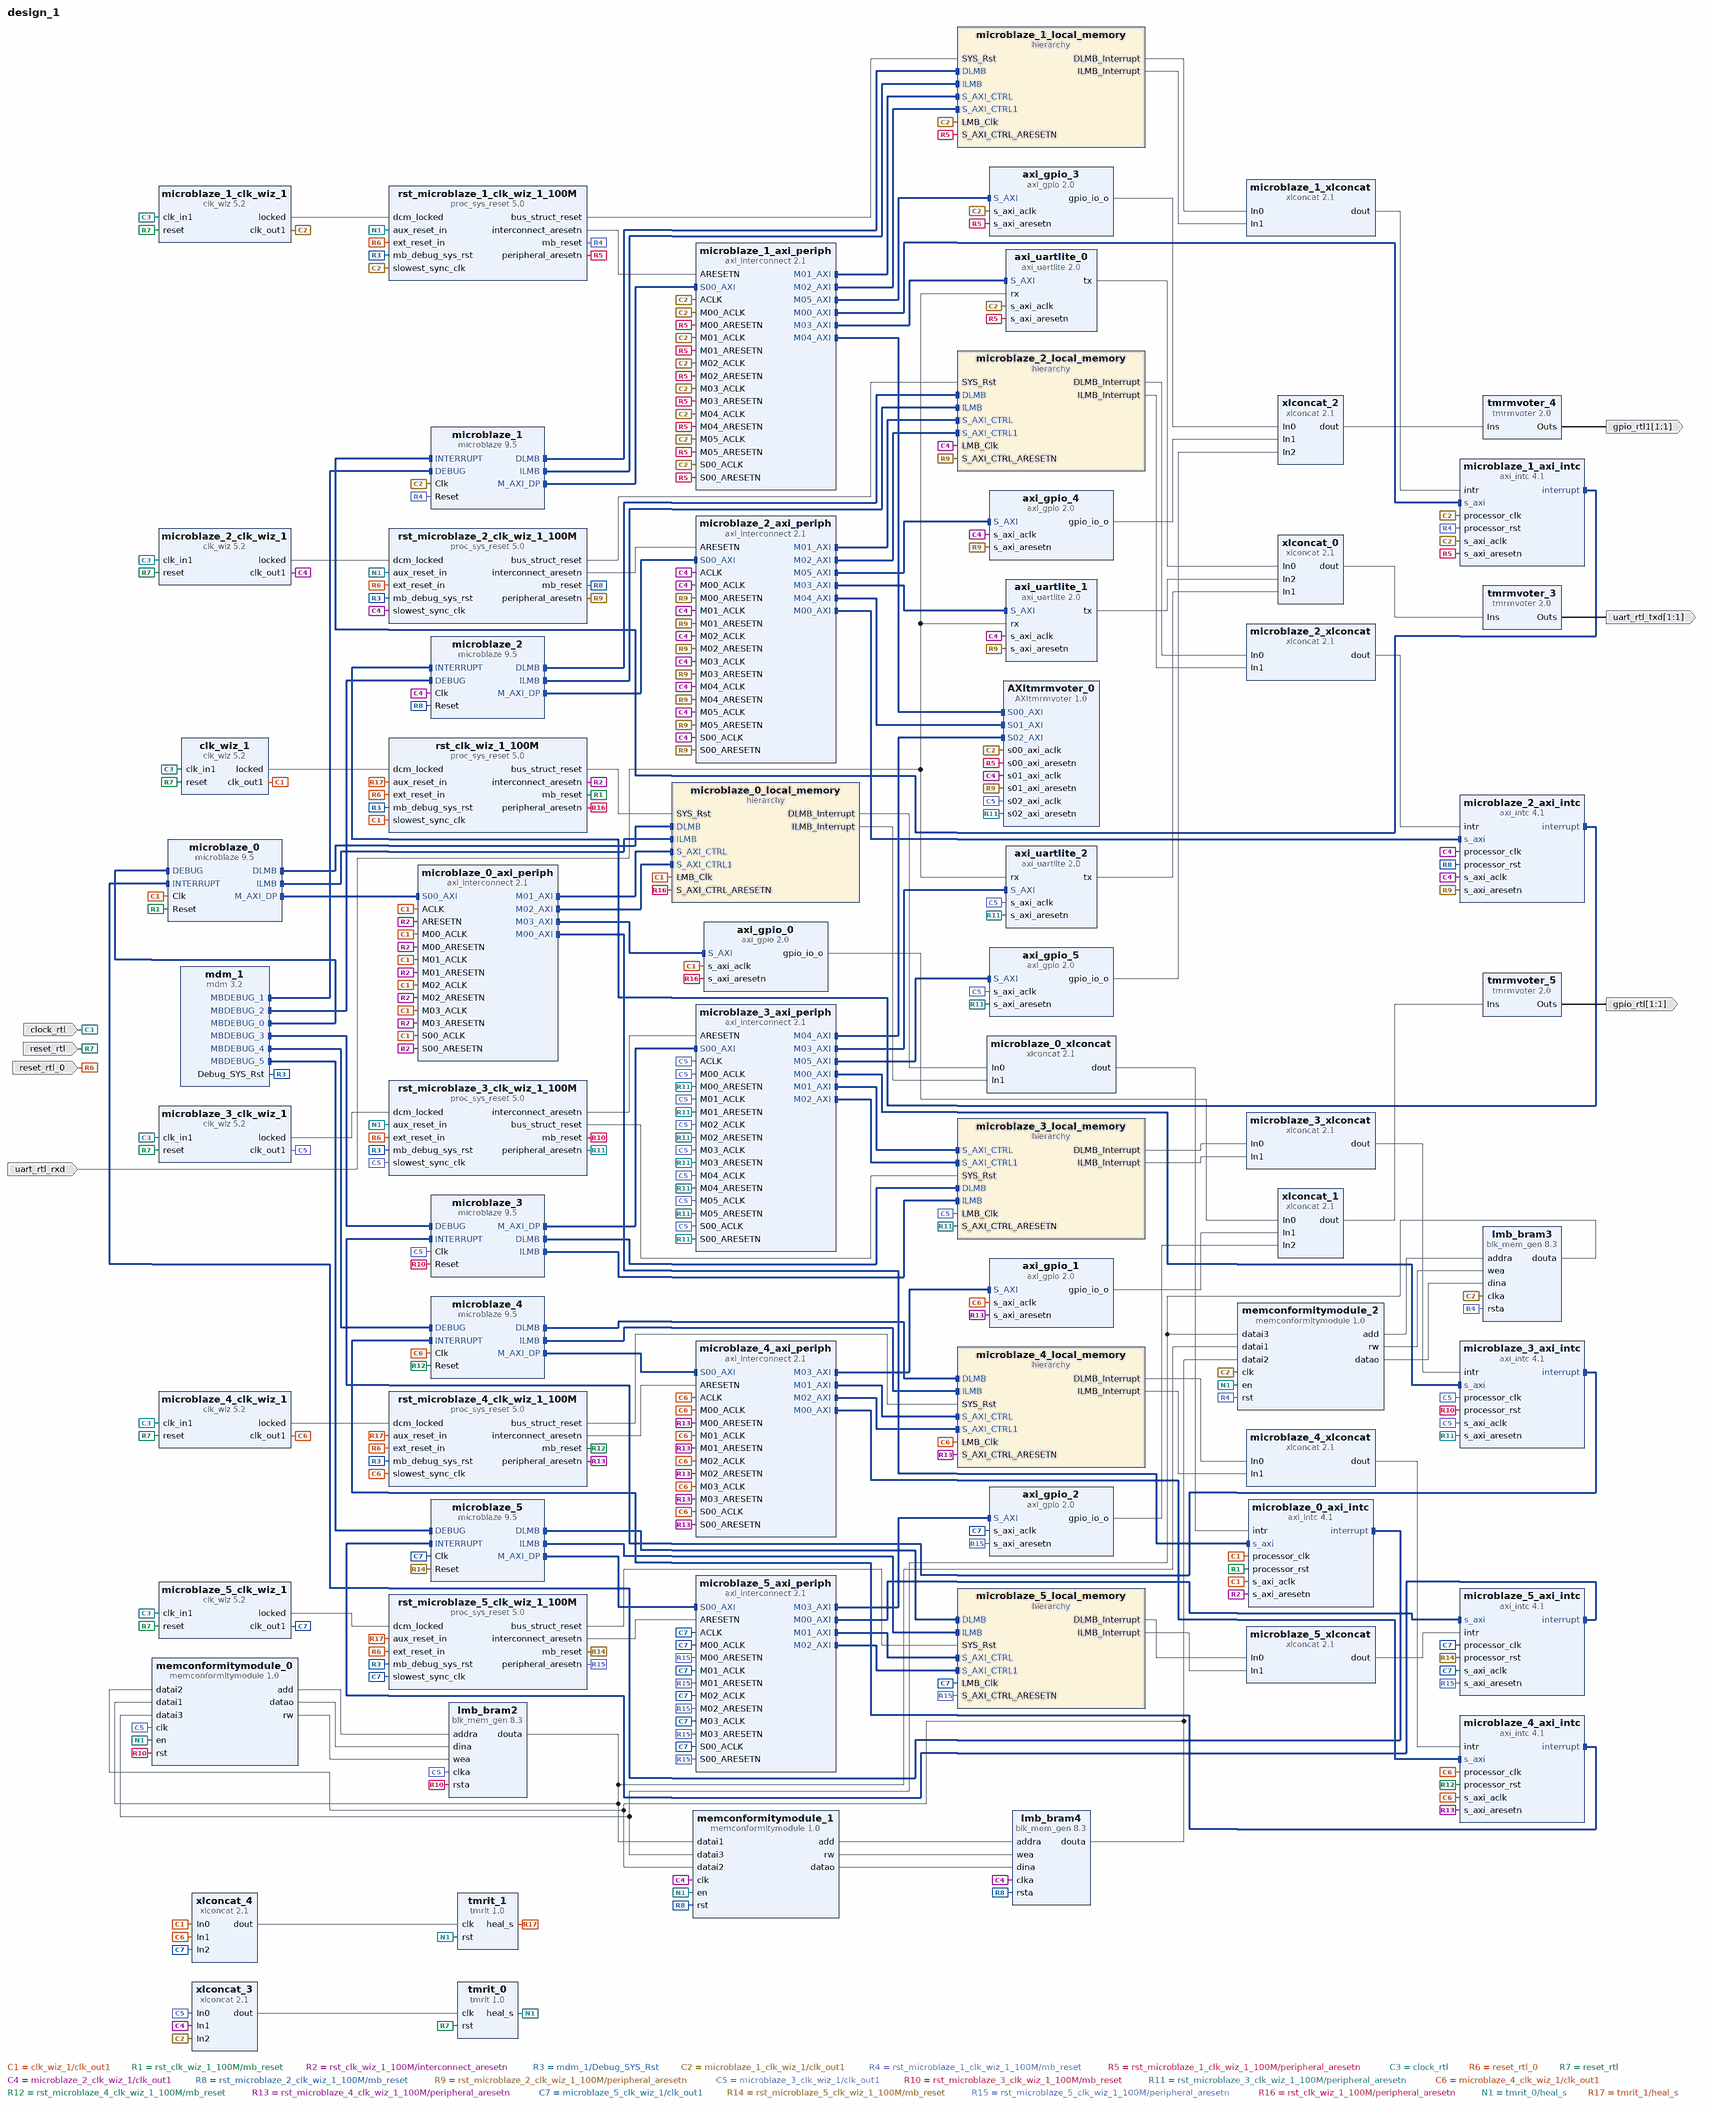
[diagram p0: block diagram of the top level]
# Vivado block design design_1, Vivado 2015.4
create_bd_design design_1

create_bd_port -dir I -type clk clock_rtl
set_property -dict {CONFIG.FREQ_HZ 100000000 CONFIG.PHASE 0.000} [get_bd_ports clock_rtl]
create_bd_port -dir I -type rst reset_rtl_0
set_property -dict {CONFIG.POLARITY ACTIVE_LOW} [get_bd_ports reset_rtl_0]
create_bd_port -dir I -type rst reset_rtl
set_property -dict {CONFIG.POLARITY ACTIVE_HIGH} [get_bd_ports reset_rtl]
create_bd_port -dir I uart_rtl_rxd
create_bd_port -dir O -from 1 -to 1 uart_rtl_txd
create_bd_port -dir O -from 1 -to 1 gpio_rtl1
create_bd_port -dir O -from 1 -to 1 gpio_rtl

create_bd_cell -type ip -vlnv xilinx.com:ip:axi_uartlite:2.0 axi_uartlite_0
create_bd_cell -type hier microblaze_0_local_memory
create_bd_cell -type ip -vlnv xilinx.com:ip:axi_intc:4.1 microblaze_0_axi_intc
set_property -dict {CONFIG.C_HAS_FAST 1} [get_bd_cells microblaze_0_axi_intc]
create_bd_cell -type ip -vlnv xilinx.com:ip:xlconcat:2.1 microblaze_0_xlconcat
create_bd_cell -type ip -vlnv xilinx.com:ip:mdm:3.2 mdm_1
set_property -dict {CONFIG.C_MB_DBG_PORTS 6} [get_bd_cells mdm_1]
create_bd_cell -type ip -vlnv xilinx.com:ip:proc_sys_reset:5.0 rst_clk_wiz_1_100M
set_property -dict {CONFIG.C_AUX_RESET_HIGH 1 CONFIG.C_AUX_RST_WIDTH 1} [get_bd_cells rst_clk_wiz_1_100M]
create_bd_cell -type hier microblaze_1_local_memory
create_bd_cell -type ip -vlnv xilinx.com:ip:axi_intc:4.1 microblaze_1_axi_intc
set_property -dict {CONFIG.C_HAS_FAST 1} [get_bd_cells microblaze_1_axi_intc]
create_bd_cell -type ip -vlnv xilinx.com:ip:xlconcat:2.1 microblaze_1_xlconcat
create_bd_cell -type ip -vlnv xilinx.com:ip:proc_sys_reset:5.0 rst_microblaze_1_clk_wiz_1_100M
set_property -dict {CONFIG.C_AUX_RESET_HIGH 1 CONFIG.C_AUX_RST_WIDTH 1} [get_bd_cells rst_microblaze_1_clk_wiz_1_100M]
create_bd_cell -type ip -vlnv xilinx.com:ip:axi_uartlite:2.0 axi_uartlite_1
create_bd_cell -type hier microblaze_2_local_memory
create_bd_cell -type ip -vlnv xilinx.com:ip:axi_intc:4.1 microblaze_2_axi_intc
set_property -dict {CONFIG.C_HAS_FAST 1} [get_bd_cells microblaze_2_axi_intc]
create_bd_cell -type ip -vlnv xilinx.com:ip:xlconcat:2.1 microblaze_2_xlconcat
create_bd_cell -type ip -vlnv xilinx.com:ip:proc_sys_reset:5.0 rst_microblaze_2_clk_wiz_1_100M
set_property -dict {CONFIG.C_AUX_RESET_HIGH 1 CONFIG.C_AUX_RST_WIDTH 1} [get_bd_cells rst_microblaze_2_clk_wiz_1_100M]
create_bd_cell -type hier microblaze_3_local_memory
create_bd_cell -type ip -vlnv xilinx.com:ip:axi_intc:4.1 microblaze_3_axi_intc
set_property -dict {CONFIG.C_HAS_FAST 1} [get_bd_cells microblaze_3_axi_intc]
create_bd_cell -type ip -vlnv xilinx.com:ip:xlconcat:2.1 microblaze_3_xlconcat
create_bd_cell -type ip -vlnv xilinx.com:ip:proc_sys_reset:5.0 rst_microblaze_3_clk_wiz_1_100M
set_property -dict {CONFIG.C_AUX_RESET_HIGH 1 CONFIG.C_AUX_RST_WIDTH 1} [get_bd_cells rst_microblaze_3_clk_wiz_1_100M]
create_bd_cell -type ip -vlnv xilinx.com:ip:axi_uartlite:2.0 axi_uartlite_2
create_bd_cell -type ip -vlnv xilinx.com:ip:xlconcat:2.1 xlconcat_0
set_property -dict {CONFIG.NUM_PORTS 3 CONFIG.IN0_WIDTH 1 CONFIG.IN1_WIDTH 1 CONFIG.IN2_WIDTH 1} [get_bd_cells xlconcat_0]
create_bd_cell -type hier microblaze_4_local_memory
create_bd_cell -type ip -vlnv xilinx.com:ip:axi_intc:4.1 microblaze_4_axi_intc
set_property -dict {CONFIG.C_HAS_FAST 1} [get_bd_cells microblaze_4_axi_intc]
create_bd_cell -type ip -vlnv xilinx.com:ip:xlconcat:2.1 microblaze_4_xlconcat
create_bd_cell -type ip -vlnv xilinx.com:ip:proc_sys_reset:5.0 rst_microblaze_4_clk_wiz_1_100M
set_property -dict {CONFIG.C_AUX_RESET_HIGH 1 CONFIG.C_AUX_RST_WIDTH 1} [get_bd_cells rst_microblaze_4_clk_wiz_1_100M]
create_bd_cell -type ip -vlnv xilinx.com:ip:xlconcat:2.1 xlconcat_1
set_property -dict {CONFIG.NUM_PORTS 3 CONFIG.IN0_WIDTH 1 CONFIG.IN1_WIDTH 1 CONFIG.IN2_WIDTH 1} [get_bd_cells xlconcat_1]
create_bd_cell -type hier microblaze_5_local_memory
create_bd_cell -type ip -vlnv xilinx.com:ip:axi_intc:4.1 microblaze_5_axi_intc
set_property -dict {CONFIG.C_HAS_FAST 1} [get_bd_cells microblaze_5_axi_intc]
create_bd_cell -type ip -vlnv xilinx.com:ip:xlconcat:2.1 microblaze_5_xlconcat
create_bd_cell -type ip -vlnv xilinx.com:ip:proc_sys_reset:5.0 rst_microblaze_5_clk_wiz_1_100M
set_property -dict {CONFIG.C_AUX_RESET_HIGH 1 CONFIG.C_AUX_RST_WIDTH 1} [get_bd_cells rst_microblaze_5_clk_wiz_1_100M]
create_bd_cell -type ip -vlnv xilinx.com:ip:axi_gpio:2.0 axi_gpio_0
set_property -dict {CONFIG.C_GPIO_WIDTH 1 CONFIG.C_ALL_OUTPUTS 1} [get_bd_cells axi_gpio_0]
create_bd_cell -type ip -vlnv xilinx.com:ip:axi_gpio:2.0 axi_gpio_1
set_property -dict {CONFIG.C_GPIO_WIDTH 1 CONFIG.C_ALL_OUTPUTS 1} [get_bd_cells axi_gpio_1]
create_bd_cell -type ip -vlnv xilinx.com:ip:axi_gpio:2.0 axi_gpio_2
set_property -dict {CONFIG.C_GPIO_WIDTH 1 CONFIG.C_ALL_OUTPUTS 1} [get_bd_cells axi_gpio_2]
create_bd_cell -type ip -vlnv xilinx.com:ip:clk_wiz:5.2 clk_wiz_1
set_property -dict [list \
  CONFIG.USE_MIN_POWER true \
  CONFIG.JITTER_SEL No_Jitter \
  CONFIG.CLKOUT1_REQUESTED_OUT_FREQ 10 \
  CONFIG.PRIM_SOURCE Single_ended_clock_capable_pin \
  CONFIG.MMCM_DIVCLK_DIVIDE 10 \
  CONFIG.MMCM_CLKFBOUT_MULT_F 60.125 \
  CONFIG.MMCM_CLKOUT0_DIVIDE_F 60.125 \
  CONFIG.MMCM_CLKOUT0_DUTY_CYCLE 0.5 \
  CONFIG.CLKOUT1_JITTER 884.502 \
  CONFIG.CLKOUT1_PHASE_ERROR 871.302 \
] [get_bd_cells clk_wiz_1]
create_bd_cell -type ip -vlnv xilinx.com:ip:microblaze:9.5 microblaze_0
set_property -dict [list \
  CONFIG.C_FAULT_TOLERANT 1 \
  CONFIG.C_D_AXI 1 \
  CONFIG.C_D_LMB 1 \
  CONFIG.C_I_LMB 1 \
  CONFIG.C_DEBUG_ENABLED 1 \
] [get_bd_cells microblaze_0]
create_bd_cell -type ip -vlnv xilinx.com:ip:microblaze:9.5 microblaze_1
set_property -dict [list \
  CONFIG.C_FAULT_TOLERANT 1 \
  CONFIG.C_D_AXI 1 \
  CONFIG.C_D_LMB 1 \
  CONFIG.C_I_LMB 1 \
  CONFIG.C_DEBUG_ENABLED 1 \
] [get_bd_cells microblaze_1]
create_bd_cell -type ip -vlnv xilinx.com:ip:microblaze:9.5 microblaze_4
set_property -dict [list \
  CONFIG.C_FAULT_TOLERANT 1 \
  CONFIG.C_D_AXI 1 \
  CONFIG.C_D_LMB 1 \
  CONFIG.C_I_LMB 1 \
  CONFIG.C_DEBUG_ENABLED 1 \
] [get_bd_cells microblaze_4]
create_bd_cell -type ip -vlnv xilinx.com:ip:axi_interconnect:2.1 microblaze_0_axi_periph
set_property -dict {CONFIG.NUM_MI 4} [get_bd_cells microblaze_0_axi_periph]
create_bd_cell -type ip -vlnv xilinx.com:ip:microblaze:9.5 microblaze_2
set_property -dict [list \
  CONFIG.C_FAULT_TOLERANT 1 \
  CONFIG.C_D_AXI 1 \
  CONFIG.C_D_LMB 1 \
  CONFIG.C_I_LMB 1 \
  CONFIG.C_DEBUG_ENABLED 1 \
] [get_bd_cells microblaze_2]
create_bd_cell -type ip -vlnv xilinx.com:ip:axi_interconnect:2.1 microblaze_1_axi_periph
set_property -dict {CONFIG.NUM_MI 6} [get_bd_cells microblaze_1_axi_periph]
create_bd_cell -type ip -vlnv xilinx.com:ip:clk_wiz:5.2 microblaze_1_clk_wiz_1
set_property -dict [list \
  CONFIG.USE_MIN_POWER true \
  CONFIG.JITTER_SEL No_Jitter \
  CONFIG.CLKOUT1_REQUESTED_OUT_FREQ 10 \
  CONFIG.PRIM_SOURCE Single_ended_clock_capable_pin \
  CONFIG.MMCM_DIVCLK_DIVIDE 10 \
  CONFIG.MMCM_CLKFBOUT_MULT_F 60.125 \
  CONFIG.MMCM_CLKOUT0_DIVIDE_F 60.125 \
  CONFIG.MMCM_CLKOUT0_DUTY_CYCLE 0.5 \
  CONFIG.CLKOUT1_JITTER 884.502 \
  CONFIG.CLKOUT1_PHASE_ERROR 871.302 \
] [get_bd_cells microblaze_1_clk_wiz_1]
create_bd_cell -type ip -vlnv xilinx.com:ip:microblaze:9.5 microblaze_3
set_property -dict [list \
  CONFIG.C_FAULT_TOLERANT 1 \
  CONFIG.C_D_AXI 1 \
  CONFIG.C_D_LMB 1 \
  CONFIG.C_I_LMB 1 \
  CONFIG.C_DEBUG_ENABLED 1 \
] [get_bd_cells microblaze_3]
create_bd_cell -type ip -vlnv xilinx.com:ip:axi_interconnect:2.1 microblaze_2_axi_periph
set_property -dict {CONFIG.NUM_MI 6} [get_bd_cells microblaze_2_axi_periph]
create_bd_cell -type ip -vlnv xilinx.com:ip:clk_wiz:5.2 microblaze_2_clk_wiz_1
set_property -dict [list \
  CONFIG.USE_MIN_POWER true \
  CONFIG.JITTER_SEL No_Jitter \
  CONFIG.CLKOUT1_REQUESTED_OUT_FREQ 10 \
  CONFIG.PRIM_SOURCE Single_ended_clock_capable_pin \
  CONFIG.MMCM_DIVCLK_DIVIDE 10 \
  CONFIG.MMCM_CLKFBOUT_MULT_F 60.125 \
  CONFIG.MMCM_CLKOUT0_DIVIDE_F 60.125 \
  CONFIG.MMCM_CLKOUT0_DUTY_CYCLE 0.5 \
  CONFIG.CLKOUT1_JITTER 884.502 \
  CONFIG.CLKOUT1_PHASE_ERROR 871.302 \
] [get_bd_cells microblaze_2_clk_wiz_1]
create_bd_cell -type ip -vlnv xilinx.com:ip:axi_interconnect:2.1 microblaze_3_axi_periph
set_property -dict {CONFIG.NUM_MI 6} [get_bd_cells microblaze_3_axi_periph]
create_bd_cell -type ip -vlnv xilinx.com:ip:clk_wiz:5.2 microblaze_3_clk_wiz_1
set_property -dict [list \
  CONFIG.USE_MIN_POWER true \
  CONFIG.JITTER_SEL No_Jitter \
  CONFIG.CLKOUT1_REQUESTED_OUT_FREQ 10 \
  CONFIG.PRIM_SOURCE Single_ended_clock_capable_pin \
  CONFIG.MMCM_DIVCLK_DIVIDE 10 \
  CONFIG.MMCM_CLKFBOUT_MULT_F 60.125 \
  CONFIG.MMCM_CLKOUT0_DIVIDE_F 60.125 \
  CONFIG.MMCM_CLKOUT0_DUTY_CYCLE 0.5 \
  CONFIG.CLKOUT1_JITTER 884.502 \
  CONFIG.CLKOUT1_PHASE_ERROR 871.302 \
] [get_bd_cells microblaze_3_clk_wiz_1]
create_bd_cell -type ip -vlnv xilinx.com:ip:microblaze:9.5 microblaze_5
set_property -dict [list \
  CONFIG.C_FAULT_TOLERANT 1 \
  CONFIG.C_D_AXI 1 \
  CONFIG.C_D_LMB 1 \
  CONFIG.C_I_LMB 1 \
  CONFIG.C_DEBUG_ENABLED 1 \
] [get_bd_cells microblaze_5]
create_bd_cell -type ip -vlnv xilinx.com:ip:axi_interconnect:2.1 microblaze_4_axi_periph
set_property -dict {CONFIG.NUM_MI 4} [get_bd_cells microblaze_4_axi_periph]
create_bd_cell -type ip -vlnv xilinx.com:ip:clk_wiz:5.2 microblaze_4_clk_wiz_1
set_property -dict [list \
  CONFIG.USE_MIN_POWER true \
  CONFIG.JITTER_SEL No_Jitter \
  CONFIG.CLKOUT1_REQUESTED_OUT_FREQ 10 \
  CONFIG.PRIM_SOURCE Single_ended_clock_capable_pin \
  CONFIG.MMCM_DIVCLK_DIVIDE 10 \
  CONFIG.MMCM_CLKFBOUT_MULT_F 60.125 \
  CONFIG.MMCM_CLKOUT0_DIVIDE_F 60.125 \
  CONFIG.MMCM_CLKOUT0_DUTY_CYCLE 0.5 \
  CONFIG.CLKOUT1_JITTER 884.502 \
  CONFIG.CLKOUT1_PHASE_ERROR 871.302 \
] [get_bd_cells microblaze_4_clk_wiz_1]
create_bd_cell -type ip -vlnv xilinx.com:ip:axi_interconnect:2.1 microblaze_5_axi_periph
set_property -dict {CONFIG.NUM_MI 4} [get_bd_cells microblaze_5_axi_periph]
create_bd_cell -type ip -vlnv xilinx.com:ip:clk_wiz:5.2 microblaze_5_clk_wiz_1
set_property -dict [list \
  CONFIG.USE_MIN_POWER true \
  CONFIG.JITTER_SEL No_Jitter \
  CONFIG.CLKOUT1_REQUESTED_OUT_FREQ 10 \
  CONFIG.PRIM_SOURCE Single_ended_clock_capable_pin \
  CONFIG.MMCM_DIVCLK_DIVIDE 10 \
  CONFIG.MMCM_CLKFBOUT_MULT_F 60.125 \
  CONFIG.MMCM_CLKOUT0_DIVIDE_F 60.125 \
  CONFIG.MMCM_CLKOUT0_DUTY_CYCLE 0.5 \
  CONFIG.CLKOUT1_JITTER 884.502 \
  CONFIG.CLKOUT1_PHASE_ERROR 871.302 \
] [get_bd_cells microblaze_5_clk_wiz_1]
create_bd_cell -type ip -vlnv xilinx.com:ip:axi_gpio:2.0 axi_gpio_3
set_property -dict {CONFIG.C_GPIO_WIDTH 1 CONFIG.C_ALL_OUTPUTS 1} [get_bd_cells axi_gpio_3]
create_bd_cell -type ip -vlnv xilinx.com:ip:axi_gpio:2.0 axi_gpio_4
set_property -dict {CONFIG.C_GPIO_WIDTH 1 CONFIG.C_ALL_OUTPUTS 1} [get_bd_cells axi_gpio_4]
create_bd_cell -type ip -vlnv xilinx.com:ip:axi_gpio:2.0 axi_gpio_5
set_property -dict {CONFIG.C_GPIO_WIDTH 1 CONFIG.C_ALL_OUTPUTS 1} [get_bd_cells axi_gpio_5]
create_bd_cell -type ip -vlnv xilinx.com:ip:xlconcat:2.1 xlconcat_2
set_property -dict {CONFIG.NUM_PORTS 3 CONFIG.IN0_WIDTH 1 CONFIG.IN1_WIDTH 1 CONFIG.IN2_WIDTH 1} [get_bd_cells xlconcat_2]
create_bd_cell -type ip -vlnv xilinx.com:ip:blk_mem_gen:8.3 lmb_bram2
set_property -dict [list \
  CONFIG.Memory_Type Single_Port_RAM \
  CONFIG.Enable_32bit_Address true \
  CONFIG.Register_PortA_Output_of_Memory_Primitives false \
  CONFIG.Use_RSTA_Pin true \
  CONFIG.Port_B_Clock 0 \
  CONFIG.Port_B_Write_Rate 0 \
  CONFIG.Port_B_Enable_Rate 0 \
  CONFIG.use_bram_block Stand_Alone \
] [get_bd_cells lmb_bram2]
create_bd_cell -type ip -vlnv xilinx.com:ip:blk_mem_gen:8.3 lmb_bram3
set_property -dict [list \
  CONFIG.Memory_Type Single_Port_RAM \
  CONFIG.Enable_32bit_Address true \
  CONFIG.Register_PortA_Output_of_Memory_Primitives false \
  CONFIG.Use_RSTA_Pin true \
  CONFIG.Port_B_Clock 0 \
  CONFIG.Port_B_Write_Rate 0 \
  CONFIG.Port_B_Enable_Rate 0 \
  CONFIG.use_bram_block Stand_Alone \
] [get_bd_cells lmb_bram3]
create_bd_cell -type ip -vlnv xilinx.com:ip:blk_mem_gen:8.3 lmb_bram4
set_property -dict [list \
  CONFIG.Memory_Type Single_Port_RAM \
  CONFIG.Enable_32bit_Address true \
  CONFIG.Register_PortA_Output_of_Memory_Primitives false \
  CONFIG.Use_RSTA_Pin true \
  CONFIG.Port_B_Clock 0 \
  CONFIG.Port_B_Write_Rate 0 \
  CONFIG.Port_B_Enable_Rate 0 \
  CONFIG.use_bram_block Stand_Alone \
] [get_bd_cells lmb_bram4]
create_bd_cell -type ip -vlnv xilinx.com:ip:xlconcat:2.1 xlconcat_3
set_property -dict {CONFIG.NUM_PORTS 3} [get_bd_cells xlconcat_3]
create_bd_cell -type ip -vlnv KTH_SEUD:user:AXItmrmvoter:1.0 AXItmrmvoter_0
create_bd_cell -type ip -vlnv kth.se:user:memconformitymodule:1.0 memconformitymodule_0
create_bd_cell -type ip -vlnv kth.se:user:memconformitymodule:1.0 memconformitymodule_1
create_bd_cell -type ip -vlnv kth.se:user:memconformitymodule:1.0 memconformitymodule_2
create_bd_cell -type ip -vlnv kth.se:user:tmrit:1.0 tmrit_0
set_property -dict {CONFIG.ComputingCounterWidth 34 CONFIG.HealingCounterWidth 4} [get_bd_cells tmrit_0]
create_bd_cell -type ip -vlnv kth.se:user:tmrmvoter:2.0 tmrmvoter_3
create_bd_cell -type ip -vlnv kth.se:user:tmrmvoter:2.0 tmrmvoter_4
create_bd_cell -type ip -vlnv kth.se:user:tmrmvoter:2.0 tmrmvoter_5
create_bd_cell -type ip -vlnv kth.se:user:tmrit:1.0 tmrit_1
set_property -dict {CONFIG.ComputingCounterWidth 34 CONFIG.HealingCounterWidth 4} [get_bd_cells tmrit_1]
create_bd_cell -type ip -vlnv xilinx.com:ip:xlconcat:2.1 xlconcat_4
set_property -dict {CONFIG.NUM_PORTS 3} [get_bd_cells xlconcat_4]

# ---- hierarchy /microblaze_0_local_memory ----
current_bd_instance /microblaze_0_local_memory
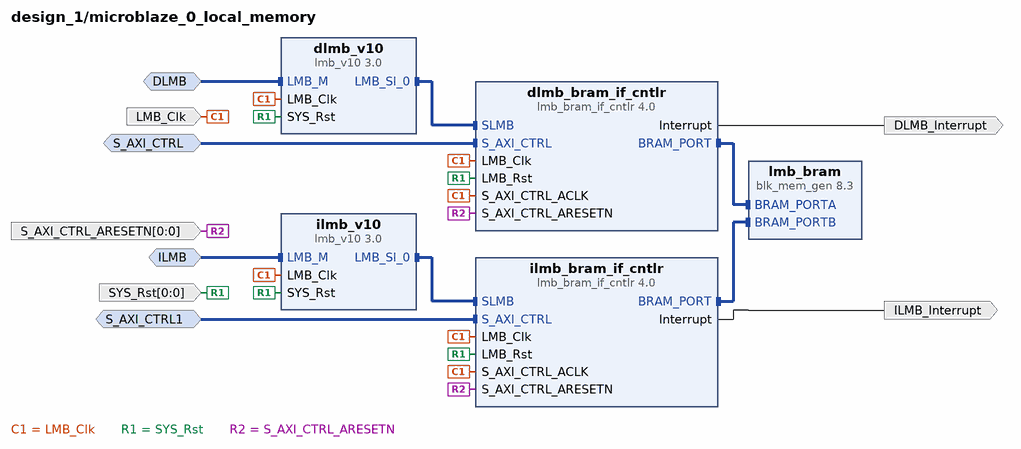
[diagram p1: block diagram inside /microblaze_0_local_memory]
create_bd_intf_pin -mode MirroredMaster -vlnv xilinx.com:interface:lmb_rtl:1.0 DLMB
create_bd_intf_pin -mode MirroredMaster -vlnv xilinx.com:interface:lmb_rtl:1.0 ILMB
create_bd_intf_pin -mode Slave -vlnv xilinx.com:interface:aximm_rtl:1.0 S_AXI_CTRL
create_bd_intf_pin -mode Slave -vlnv xilinx.com:interface:aximm_rtl:1.0 S_AXI_CTRL1
create_bd_pin -dir O -type intr DLMB_Interrupt
create_bd_pin -dir O -type intr ILMB_Interrupt
create_bd_pin -dir I -type clk LMB_Clk
create_bd_pin -dir I -from 0 -to 0 -type rst SYS_Rst
create_bd_pin -dir I -from 0 -to 0 -type rst S_AXI_CTRL_ARESETN

create_bd_cell -type ip -vlnv xilinx.com:ip:lmb_v10:3.0 dlmb_v10
create_bd_cell -type ip -vlnv xilinx.com:ip:lmb_v10:3.0 ilmb_v10
create_bd_cell -type ip -vlnv xilinx.com:ip:lmb_bram_if_cntlr:4.0 dlmb_bram_if_cntlr
set_property -dict [list \
  CONFIG.C_ECC 1 \
  CONFIG.C_INTERCONNECT 2 \
  CONFIG.C_FAULT_INJECT 1 \
  CONFIG.C_CE_FAILING_REGISTERS 1 \
  CONFIG.C_UE_FAILING_REGISTERS 1 \
  CONFIG.C_ECC_STATUS_REGISTERS 1 \
  CONFIG.C_ECC_ONOFF_REGISTER 1 \
  CONFIG.C_CE_COUNTER_WIDTH 20 \
] [get_bd_cells dlmb_bram_if_cntlr]
create_bd_cell -type ip -vlnv xilinx.com:ip:lmb_bram_if_cntlr:4.0 ilmb_bram_if_cntlr
set_property -dict [list \
  CONFIG.C_ECC 1 \
  CONFIG.C_INTERCONNECT 2 \
  CONFIG.C_CE_FAILING_REGISTERS 1 \
  CONFIG.C_UE_FAILING_REGISTERS 1 \
  CONFIG.C_ECC_STATUS_REGISTERS 1 \
  CONFIG.C_ECC_ONOFF_REGISTER 1 \
  CONFIG.C_CE_COUNTER_WIDTH 20 \
  CONFIG.C_WRITE_ACCESS 0 \
] [get_bd_cells ilmb_bram_if_cntlr]
create_bd_cell -type ip -vlnv xilinx.com:ip:blk_mem_gen:8.3 lmb_bram
set_property -dict {CONFIG.Memory_Type True_Dual_Port_RAM CONFIG.use_bram_block BRAM_Controller} [get_bd_cells lmb_bram]

# ---- hierarchy /microblaze_1_local_memory ----
current_bd_instance /microblaze_1_local_memory
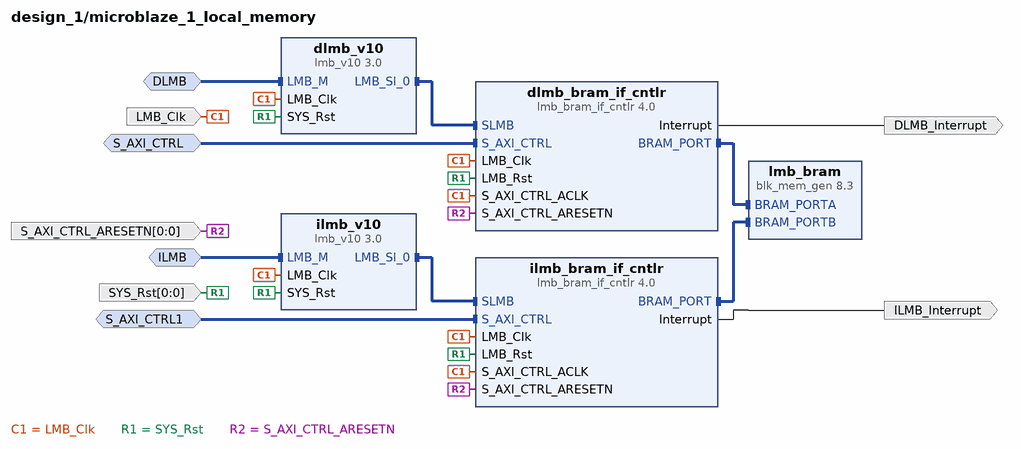
[diagram p2: block diagram inside /microblaze_1_local_memory]
create_bd_intf_pin -mode MirroredMaster -vlnv xilinx.com:interface:lmb_rtl:1.0 DLMB
create_bd_intf_pin -mode MirroredMaster -vlnv xilinx.com:interface:lmb_rtl:1.0 ILMB
create_bd_intf_pin -mode Slave -vlnv xilinx.com:interface:aximm_rtl:1.0 S_AXI_CTRL
create_bd_intf_pin -mode Slave -vlnv xilinx.com:interface:aximm_rtl:1.0 S_AXI_CTRL1
create_bd_pin -dir O -type intr DLMB_Interrupt
create_bd_pin -dir O -type intr ILMB_Interrupt
create_bd_pin -dir I -type clk LMB_Clk
create_bd_pin -dir I -from 0 -to 0 -type rst SYS_Rst
create_bd_pin -dir I -from 0 -to 0 -type rst S_AXI_CTRL_ARESETN

create_bd_cell -type ip -vlnv xilinx.com:ip:lmb_v10:3.0 dlmb_v10
create_bd_cell -type ip -vlnv xilinx.com:ip:lmb_v10:3.0 ilmb_v10
create_bd_cell -type ip -vlnv xilinx.com:ip:lmb_bram_if_cntlr:4.0 dlmb_bram_if_cntlr
set_property -dict [list \
  CONFIG.C_ECC 1 \
  CONFIG.C_INTERCONNECT 2 \
  CONFIG.C_FAULT_INJECT 1 \
  CONFIG.C_CE_FAILING_REGISTERS 1 \
  CONFIG.C_UE_FAILING_REGISTERS 1 \
  CONFIG.C_ECC_STATUS_REGISTERS 1 \
  CONFIG.C_ECC_ONOFF_REGISTER 1 \
  CONFIG.C_CE_COUNTER_WIDTH 20 \
] [get_bd_cells dlmb_bram_if_cntlr]
create_bd_cell -type ip -vlnv xilinx.com:ip:lmb_bram_if_cntlr:4.0 ilmb_bram_if_cntlr
set_property -dict [list \
  CONFIG.C_ECC 1 \
  CONFIG.C_INTERCONNECT 2 \
  CONFIG.C_CE_FAILING_REGISTERS 1 \
  CONFIG.C_UE_FAILING_REGISTERS 1 \
  CONFIG.C_ECC_STATUS_REGISTERS 1 \
  CONFIG.C_ECC_ONOFF_REGISTER 1 \
  CONFIG.C_CE_COUNTER_WIDTH 20 \
  CONFIG.C_WRITE_ACCESS 0 \
] [get_bd_cells ilmb_bram_if_cntlr]
create_bd_cell -type ip -vlnv xilinx.com:ip:blk_mem_gen:8.3 lmb_bram
set_property -dict {CONFIG.Memory_Type True_Dual_Port_RAM CONFIG.use_bram_block BRAM_Controller} [get_bd_cells lmb_bram]

# ---- hierarchy /microblaze_2_local_memory ----
current_bd_instance /microblaze_2_local_memory
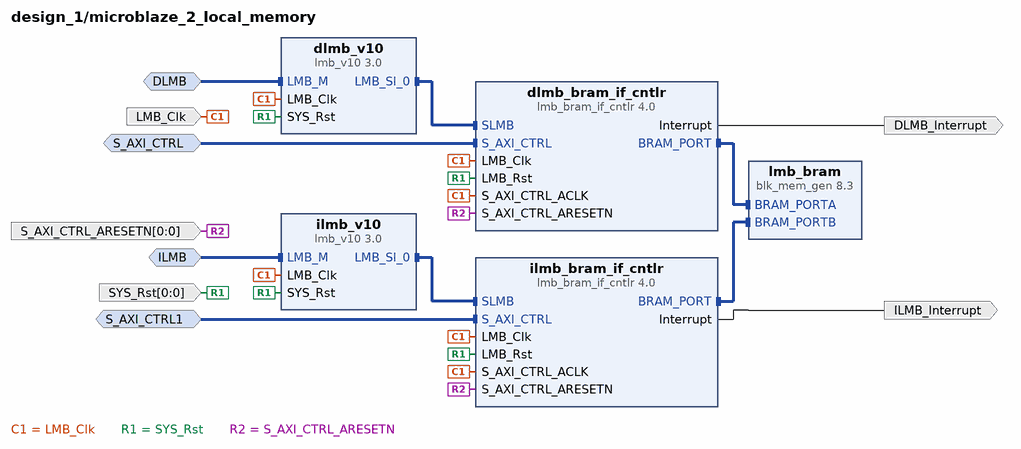
[diagram p3: block diagram inside /microblaze_2_local_memory]
create_bd_intf_pin -mode MirroredMaster -vlnv xilinx.com:interface:lmb_rtl:1.0 DLMB
create_bd_intf_pin -mode MirroredMaster -vlnv xilinx.com:interface:lmb_rtl:1.0 ILMB
create_bd_intf_pin -mode Slave -vlnv xilinx.com:interface:aximm_rtl:1.0 S_AXI_CTRL
create_bd_intf_pin -mode Slave -vlnv xilinx.com:interface:aximm_rtl:1.0 S_AXI_CTRL1
create_bd_pin -dir O -type intr DLMB_Interrupt
create_bd_pin -dir O -type intr ILMB_Interrupt
create_bd_pin -dir I -type clk LMB_Clk
create_bd_pin -dir I -from 0 -to 0 -type rst SYS_Rst
create_bd_pin -dir I -from 0 -to 0 -type rst S_AXI_CTRL_ARESETN

create_bd_cell -type ip -vlnv xilinx.com:ip:lmb_v10:3.0 dlmb_v10
create_bd_cell -type ip -vlnv xilinx.com:ip:lmb_v10:3.0 ilmb_v10
create_bd_cell -type ip -vlnv xilinx.com:ip:lmb_bram_if_cntlr:4.0 dlmb_bram_if_cntlr
set_property -dict [list \
  CONFIG.C_ECC 1 \
  CONFIG.C_INTERCONNECT 2 \
  CONFIG.C_FAULT_INJECT 1 \
  CONFIG.C_CE_FAILING_REGISTERS 1 \
  CONFIG.C_UE_FAILING_REGISTERS 1 \
  CONFIG.C_ECC_STATUS_REGISTERS 1 \
  CONFIG.C_ECC_ONOFF_REGISTER 1 \
  CONFIG.C_CE_COUNTER_WIDTH 20 \
] [get_bd_cells dlmb_bram_if_cntlr]
create_bd_cell -type ip -vlnv xilinx.com:ip:lmb_bram_if_cntlr:4.0 ilmb_bram_if_cntlr
set_property -dict [list \
  CONFIG.C_ECC 1 \
  CONFIG.C_INTERCONNECT 2 \
  CONFIG.C_CE_FAILING_REGISTERS 1 \
  CONFIG.C_UE_FAILING_REGISTERS 1 \
  CONFIG.C_ECC_STATUS_REGISTERS 1 \
  CONFIG.C_ECC_ONOFF_REGISTER 1 \
  CONFIG.C_CE_COUNTER_WIDTH 20 \
  CONFIG.C_WRITE_ACCESS 0 \
] [get_bd_cells ilmb_bram_if_cntlr]
create_bd_cell -type ip -vlnv xilinx.com:ip:blk_mem_gen:8.3 lmb_bram
set_property -dict {CONFIG.Memory_Type True_Dual_Port_RAM CONFIG.use_bram_block BRAM_Controller} [get_bd_cells lmb_bram]

# ---- hierarchy /microblaze_3_local_memory ----
current_bd_instance /microblaze_3_local_memory
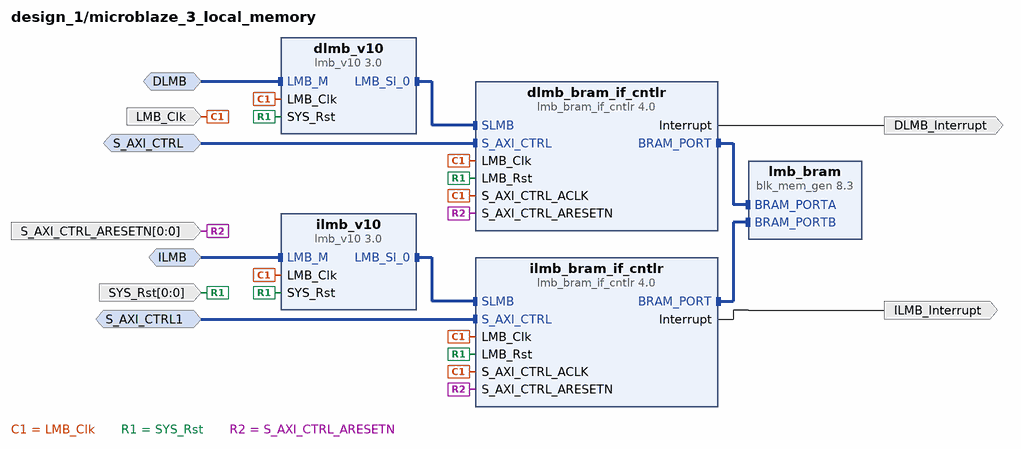
[diagram p4: block diagram inside /microblaze_3_local_memory]
create_bd_intf_pin -mode MirroredMaster -vlnv xilinx.com:interface:lmb_rtl:1.0 DLMB
create_bd_intf_pin -mode MirroredMaster -vlnv xilinx.com:interface:lmb_rtl:1.0 ILMB
create_bd_intf_pin -mode Slave -vlnv xilinx.com:interface:aximm_rtl:1.0 S_AXI_CTRL
create_bd_intf_pin -mode Slave -vlnv xilinx.com:interface:aximm_rtl:1.0 S_AXI_CTRL1
create_bd_pin -dir O -type intr DLMB_Interrupt
create_bd_pin -dir O -type intr ILMB_Interrupt
create_bd_pin -dir I -type clk LMB_Clk
create_bd_pin -dir I -from 0 -to 0 -type rst SYS_Rst
create_bd_pin -dir I -from 0 -to 0 -type rst S_AXI_CTRL_ARESETN

create_bd_cell -type ip -vlnv xilinx.com:ip:lmb_v10:3.0 dlmb_v10
create_bd_cell -type ip -vlnv xilinx.com:ip:lmb_v10:3.0 ilmb_v10
create_bd_cell -type ip -vlnv xilinx.com:ip:lmb_bram_if_cntlr:4.0 dlmb_bram_if_cntlr
set_property -dict [list \
  CONFIG.C_ECC 1 \
  CONFIG.C_INTERCONNECT 2 \
  CONFIG.C_FAULT_INJECT 1 \
  CONFIG.C_CE_FAILING_REGISTERS 1 \
  CONFIG.C_UE_FAILING_REGISTERS 1 \
  CONFIG.C_ECC_STATUS_REGISTERS 1 \
  CONFIG.C_ECC_ONOFF_REGISTER 1 \
  CONFIG.C_CE_COUNTER_WIDTH 20 \
] [get_bd_cells dlmb_bram_if_cntlr]
create_bd_cell -type ip -vlnv xilinx.com:ip:lmb_bram_if_cntlr:4.0 ilmb_bram_if_cntlr
set_property -dict [list \
  CONFIG.C_ECC 1 \
  CONFIG.C_INTERCONNECT 2 \
  CONFIG.C_CE_FAILING_REGISTERS 1 \
  CONFIG.C_UE_FAILING_REGISTERS 1 \
  CONFIG.C_ECC_STATUS_REGISTERS 1 \
  CONFIG.C_ECC_ONOFF_REGISTER 1 \
  CONFIG.C_CE_COUNTER_WIDTH 20 \
  CONFIG.C_WRITE_ACCESS 0 \
] [get_bd_cells ilmb_bram_if_cntlr]
create_bd_cell -type ip -vlnv xilinx.com:ip:blk_mem_gen:8.3 lmb_bram
set_property -dict {CONFIG.Memory_Type True_Dual_Port_RAM CONFIG.use_bram_block BRAM_Controller} [get_bd_cells lmb_bram]

# ---- hierarchy /microblaze_4_local_memory ----
current_bd_instance /microblaze_4_local_memory
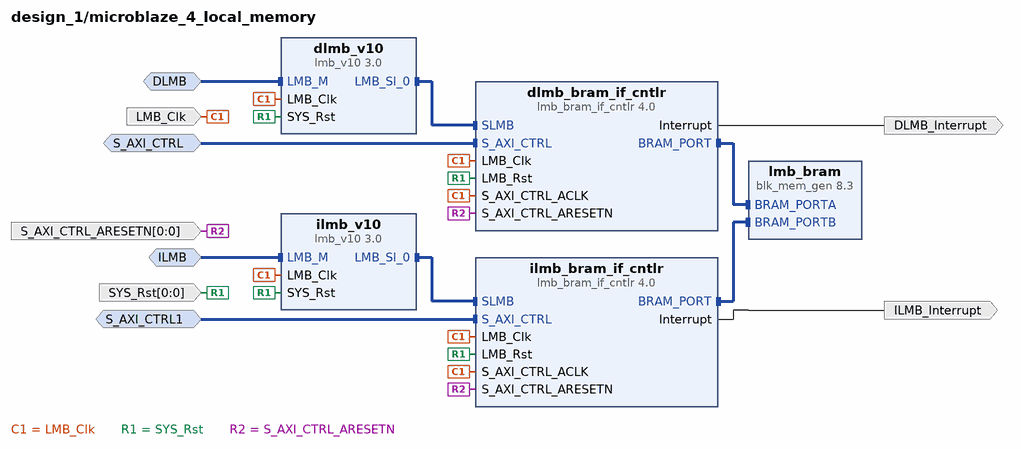
[diagram p5: block diagram inside /microblaze_4_local_memory]
create_bd_intf_pin -mode MirroredMaster -vlnv xilinx.com:interface:lmb_rtl:1.0 DLMB
create_bd_intf_pin -mode MirroredMaster -vlnv xilinx.com:interface:lmb_rtl:1.0 ILMB
create_bd_intf_pin -mode Slave -vlnv xilinx.com:interface:aximm_rtl:1.0 S_AXI_CTRL
create_bd_intf_pin -mode Slave -vlnv xilinx.com:interface:aximm_rtl:1.0 S_AXI_CTRL1
create_bd_pin -dir O -type intr DLMB_Interrupt
create_bd_pin -dir O -type intr ILMB_Interrupt
create_bd_pin -dir I -type clk LMB_Clk
create_bd_pin -dir I -from 0 -to 0 -type rst SYS_Rst
create_bd_pin -dir I -from 0 -to 0 -type rst S_AXI_CTRL_ARESETN

create_bd_cell -type ip -vlnv xilinx.com:ip:lmb_v10:3.0 dlmb_v10
create_bd_cell -type ip -vlnv xilinx.com:ip:lmb_v10:3.0 ilmb_v10
create_bd_cell -type ip -vlnv xilinx.com:ip:lmb_bram_if_cntlr:4.0 dlmb_bram_if_cntlr
set_property -dict [list \
  CONFIG.C_ECC 1 \
  CONFIG.C_INTERCONNECT 2 \
  CONFIG.C_FAULT_INJECT 1 \
  CONFIG.C_CE_FAILING_REGISTERS 1 \
  CONFIG.C_UE_FAILING_REGISTERS 1 \
  CONFIG.C_ECC_STATUS_REGISTERS 1 \
  CONFIG.C_ECC_ONOFF_REGISTER 1 \
  CONFIG.C_CE_COUNTER_WIDTH 20 \
] [get_bd_cells dlmb_bram_if_cntlr]
create_bd_cell -type ip -vlnv xilinx.com:ip:lmb_bram_if_cntlr:4.0 ilmb_bram_if_cntlr
set_property -dict [list \
  CONFIG.C_ECC 1 \
  CONFIG.C_INTERCONNECT 2 \
  CONFIG.C_CE_FAILING_REGISTERS 1 \
  CONFIG.C_UE_FAILING_REGISTERS 1 \
  CONFIG.C_ECC_STATUS_REGISTERS 1 \
  CONFIG.C_ECC_ONOFF_REGISTER 1 \
  CONFIG.C_CE_COUNTER_WIDTH 20 \
  CONFIG.C_WRITE_ACCESS 0 \
] [get_bd_cells ilmb_bram_if_cntlr]
create_bd_cell -type ip -vlnv xilinx.com:ip:blk_mem_gen:8.3 lmb_bram
set_property -dict {CONFIG.Memory_Type True_Dual_Port_RAM CONFIG.use_bram_block BRAM_Controller} [get_bd_cells lmb_bram]

# ---- hierarchy /microblaze_5_local_memory ----
current_bd_instance /microblaze_5_local_memory
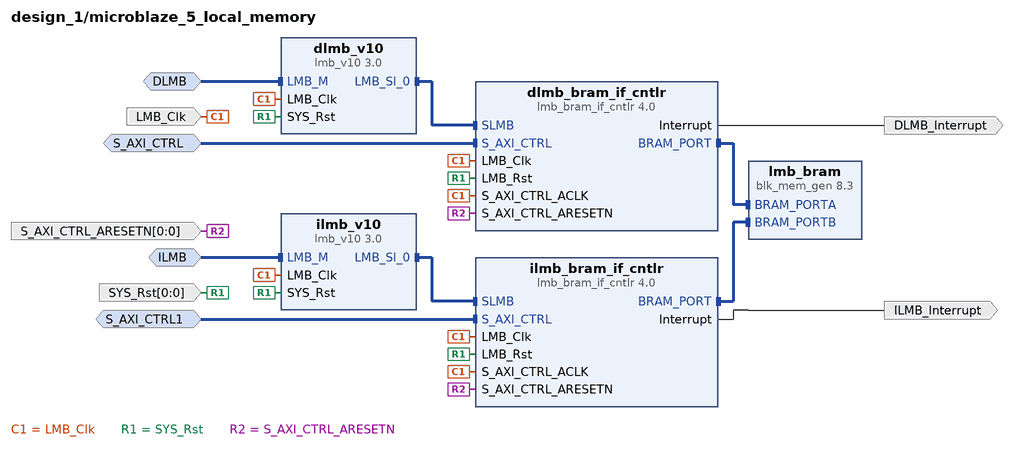
[diagram p6: block diagram inside /microblaze_5_local_memory]
create_bd_intf_pin -mode MirroredMaster -vlnv xilinx.com:interface:lmb_rtl:1.0 DLMB
create_bd_intf_pin -mode MirroredMaster -vlnv xilinx.com:interface:lmb_rtl:1.0 ILMB
create_bd_intf_pin -mode Slave -vlnv xilinx.com:interface:aximm_rtl:1.0 S_AXI_CTRL
create_bd_intf_pin -mode Slave -vlnv xilinx.com:interface:aximm_rtl:1.0 S_AXI_CTRL1
create_bd_pin -dir O -type intr DLMB_Interrupt
create_bd_pin -dir O -type intr ILMB_Interrupt
create_bd_pin -dir I -type clk LMB_Clk
create_bd_pin -dir I -from 0 -to 0 -type rst SYS_Rst
create_bd_pin -dir I -from 0 -to 0 -type rst S_AXI_CTRL_ARESETN

create_bd_cell -type ip -vlnv xilinx.com:ip:lmb_v10:3.0 dlmb_v10
create_bd_cell -type ip -vlnv xilinx.com:ip:lmb_v10:3.0 ilmb_v10
create_bd_cell -type ip -vlnv xilinx.com:ip:lmb_bram_if_cntlr:4.0 dlmb_bram_if_cntlr
set_property -dict [list \
  CONFIG.C_ECC 1 \
  CONFIG.C_INTERCONNECT 2 \
  CONFIG.C_FAULT_INJECT 1 \
  CONFIG.C_CE_FAILING_REGISTERS 1 \
  CONFIG.C_UE_FAILING_REGISTERS 1 \
  CONFIG.C_ECC_STATUS_REGISTERS 1 \
  CONFIG.C_ECC_ONOFF_REGISTER 1 \
  CONFIG.C_CE_COUNTER_WIDTH 20 \
] [get_bd_cells dlmb_bram_if_cntlr]
create_bd_cell -type ip -vlnv xilinx.com:ip:lmb_bram_if_cntlr:4.0 ilmb_bram_if_cntlr
set_property -dict [list \
  CONFIG.C_ECC 1 \
  CONFIG.C_INTERCONNECT 2 \
  CONFIG.C_CE_FAILING_REGISTERS 1 \
  CONFIG.C_UE_FAILING_REGISTERS 1 \
  CONFIG.C_ECC_STATUS_REGISTERS 1 \
  CONFIG.C_ECC_ONOFF_REGISTER 1 \
  CONFIG.C_CE_COUNTER_WIDTH 20 \
  CONFIG.C_WRITE_ACCESS 0 \
] [get_bd_cells ilmb_bram_if_cntlr]
create_bd_cell -type ip -vlnv xilinx.com:ip:blk_mem_gen:8.3 lmb_bram
set_property -dict {CONFIG.Memory_Type True_Dual_Port_RAM CONFIG.use_bram_block BRAM_Controller} [get_bd_cells lmb_bram]

# ---- connections ----

current_bd_instance /microblaze_0_local_memory
connect_bd_intf_net [get_bd_intf_pins dlmb_v10/LMB_Sl_0] [get_bd_intf_pins dlmb_bram_if_cntlr/SLMB]
connect_bd_intf_net [get_bd_intf_pins ilmb_v10/LMB_Sl_0] [get_bd_intf_pins ilmb_bram_if_cntlr/SLMB]
connect_bd_intf_net [get_bd_intf_pins dlmb_bram_if_cntlr/BRAM_PORT] [get_bd_intf_pins lmb_bram/BRAM_PORTA]
connect_bd_intf_net [get_bd_intf_pins ilmb_bram_if_cntlr/BRAM_PORT] [get_bd_intf_pins lmb_bram/BRAM_PORTB]
connect_bd_intf_net [get_bd_intf_pins DLMB] [get_bd_intf_pins dlmb_v10/LMB_M]
connect_bd_intf_net [get_bd_intf_pins ILMB] [get_bd_intf_pins ilmb_v10/LMB_M]
connect_bd_intf_net [get_bd_intf_pins S_AXI_CTRL] [get_bd_intf_pins dlmb_bram_if_cntlr/S_AXI_CTRL]
connect_bd_intf_net [get_bd_intf_pins S_AXI_CTRL1] [get_bd_intf_pins ilmb_bram_if_cntlr/S_AXI_CTRL]
connect_bd_net -net microblaze_0_Clk [get_bd_pins LMB_Clk] \
  [get_bd_pins dlmb_v10/LMB_Clk] [get_bd_pins dlmb_bram_if_cntlr/LMB_Clk] [get_bd_pins ilmb_v10/LMB_Clk] \
  [get_bd_pins ilmb_bram_if_cntlr/LMB_Clk] [get_bd_pins dlmb_bram_if_cntlr/S_AXI_CTRL_ACLK] \
  [get_bd_pins ilmb_bram_if_cntlr/S_AXI_CTRL_ACLK]
connect_bd_net -net microblaze_0_dlmb_int [get_bd_pins dlmb_bram_if_cntlr/Interrupt] [get_bd_pins DLMB_Interrupt]
connect_bd_net -net microblaze_0_ilmb_int [get_bd_pins ilmb_bram_if_cntlr/Interrupt] [get_bd_pins ILMB_Interrupt]
connect_bd_net [get_bd_pins SYS_Rst] \
  [get_bd_pins dlmb_v10/SYS_Rst] [get_bd_pins dlmb_bram_if_cntlr/LMB_Rst] [get_bd_pins ilmb_v10/SYS_Rst] \
  [get_bd_pins ilmb_bram_if_cntlr/LMB_Rst]
connect_bd_net [get_bd_pins S_AXI_CTRL_ARESETN] \
  [get_bd_pins dlmb_bram_if_cntlr/S_AXI_CTRL_ARESETN] [get_bd_pins ilmb_bram_if_cntlr/S_AXI_CTRL_ARESETN]

current_bd_instance /microblaze_1_local_memory
connect_bd_intf_net [get_bd_intf_pins dlmb_v10/LMB_Sl_0] [get_bd_intf_pins dlmb_bram_if_cntlr/SLMB]
connect_bd_intf_net [get_bd_intf_pins ilmb_v10/LMB_Sl_0] [get_bd_intf_pins ilmb_bram_if_cntlr/SLMB]
connect_bd_intf_net [get_bd_intf_pins dlmb_bram_if_cntlr/BRAM_PORT] [get_bd_intf_pins lmb_bram/BRAM_PORTA]
connect_bd_intf_net [get_bd_intf_pins ilmb_bram_if_cntlr/BRAM_PORT] [get_bd_intf_pins lmb_bram/BRAM_PORTB]
connect_bd_intf_net [get_bd_intf_pins DLMB] [get_bd_intf_pins dlmb_v10/LMB_M]
connect_bd_intf_net [get_bd_intf_pins ILMB] [get_bd_intf_pins ilmb_v10/LMB_M]
connect_bd_intf_net [get_bd_intf_pins S_AXI_CTRL] [get_bd_intf_pins dlmb_bram_if_cntlr/S_AXI_CTRL]
connect_bd_intf_net [get_bd_intf_pins S_AXI_CTRL1] [get_bd_intf_pins ilmb_bram_if_cntlr/S_AXI_CTRL]
connect_bd_net -net microblaze_1_Clk [get_bd_pins LMB_Clk] \
  [get_bd_pins dlmb_v10/LMB_Clk] [get_bd_pins dlmb_bram_if_cntlr/LMB_Clk] [get_bd_pins ilmb_v10/LMB_Clk] \
  [get_bd_pins ilmb_bram_if_cntlr/LMB_Clk] [get_bd_pins dlmb_bram_if_cntlr/S_AXI_CTRL_ACLK] \
  [get_bd_pins ilmb_bram_if_cntlr/S_AXI_CTRL_ACLK]
connect_bd_net -net microblaze_1_dlmb_int [get_bd_pins dlmb_bram_if_cntlr/Interrupt] [get_bd_pins DLMB_Interrupt]
connect_bd_net -net microblaze_1_ilmb_int [get_bd_pins ilmb_bram_if_cntlr/Interrupt] [get_bd_pins ILMB_Interrupt]
connect_bd_net [get_bd_pins SYS_Rst] \
  [get_bd_pins dlmb_v10/SYS_Rst] [get_bd_pins dlmb_bram_if_cntlr/LMB_Rst] [get_bd_pins ilmb_v10/SYS_Rst] \
  [get_bd_pins ilmb_bram_if_cntlr/LMB_Rst]
connect_bd_net [get_bd_pins S_AXI_CTRL_ARESETN] \
  [get_bd_pins dlmb_bram_if_cntlr/S_AXI_CTRL_ARESETN] [get_bd_pins ilmb_bram_if_cntlr/S_AXI_CTRL_ARESETN]

current_bd_instance /microblaze_2_local_memory
connect_bd_intf_net [get_bd_intf_pins dlmb_v10/LMB_Sl_0] [get_bd_intf_pins dlmb_bram_if_cntlr/SLMB]
connect_bd_intf_net [get_bd_intf_pins ilmb_v10/LMB_Sl_0] [get_bd_intf_pins ilmb_bram_if_cntlr/SLMB]
connect_bd_intf_net [get_bd_intf_pins dlmb_bram_if_cntlr/BRAM_PORT] [get_bd_intf_pins lmb_bram/BRAM_PORTA]
connect_bd_intf_net [get_bd_intf_pins ilmb_bram_if_cntlr/BRAM_PORT] [get_bd_intf_pins lmb_bram/BRAM_PORTB]
connect_bd_intf_net [get_bd_intf_pins DLMB] [get_bd_intf_pins dlmb_v10/LMB_M]
connect_bd_intf_net [get_bd_intf_pins ILMB] [get_bd_intf_pins ilmb_v10/LMB_M]
connect_bd_intf_net [get_bd_intf_pins S_AXI_CTRL] [get_bd_intf_pins dlmb_bram_if_cntlr/S_AXI_CTRL]
connect_bd_intf_net [get_bd_intf_pins S_AXI_CTRL1] [get_bd_intf_pins ilmb_bram_if_cntlr/S_AXI_CTRL]
connect_bd_net -net microblaze_2_Clk [get_bd_pins LMB_Clk] \
  [get_bd_pins dlmb_v10/LMB_Clk] [get_bd_pins dlmb_bram_if_cntlr/LMB_Clk] [get_bd_pins ilmb_v10/LMB_Clk] \
  [get_bd_pins ilmb_bram_if_cntlr/LMB_Clk] [get_bd_pins dlmb_bram_if_cntlr/S_AXI_CTRL_ACLK] \
  [get_bd_pins ilmb_bram_if_cntlr/S_AXI_CTRL_ACLK]
connect_bd_net -net microblaze_2_dlmb_int [get_bd_pins dlmb_bram_if_cntlr/Interrupt] [get_bd_pins DLMB_Interrupt]
connect_bd_net -net microblaze_2_ilmb_int [get_bd_pins ilmb_bram_if_cntlr/Interrupt] [get_bd_pins ILMB_Interrupt]
connect_bd_net [get_bd_pins SYS_Rst] \
  [get_bd_pins dlmb_v10/SYS_Rst] [get_bd_pins dlmb_bram_if_cntlr/LMB_Rst] [get_bd_pins ilmb_v10/SYS_Rst] \
  [get_bd_pins ilmb_bram_if_cntlr/LMB_Rst]
connect_bd_net [get_bd_pins S_AXI_CTRL_ARESETN] \
  [get_bd_pins dlmb_bram_if_cntlr/S_AXI_CTRL_ARESETN] [get_bd_pins ilmb_bram_if_cntlr/S_AXI_CTRL_ARESETN]

current_bd_instance /microblaze_3_local_memory
connect_bd_intf_net [get_bd_intf_pins dlmb_v10/LMB_Sl_0] [get_bd_intf_pins dlmb_bram_if_cntlr/SLMB]
connect_bd_intf_net [get_bd_intf_pins ilmb_v10/LMB_Sl_0] [get_bd_intf_pins ilmb_bram_if_cntlr/SLMB]
connect_bd_intf_net [get_bd_intf_pins dlmb_bram_if_cntlr/BRAM_PORT] [get_bd_intf_pins lmb_bram/BRAM_PORTA]
connect_bd_intf_net [get_bd_intf_pins ilmb_bram_if_cntlr/BRAM_PORT] [get_bd_intf_pins lmb_bram/BRAM_PORTB]
connect_bd_intf_net [get_bd_intf_pins DLMB] [get_bd_intf_pins dlmb_v10/LMB_M]
connect_bd_intf_net [get_bd_intf_pins ILMB] [get_bd_intf_pins ilmb_v10/LMB_M]
connect_bd_intf_net [get_bd_intf_pins S_AXI_CTRL] [get_bd_intf_pins dlmb_bram_if_cntlr/S_AXI_CTRL]
connect_bd_intf_net [get_bd_intf_pins S_AXI_CTRL1] [get_bd_intf_pins ilmb_bram_if_cntlr/S_AXI_CTRL]
connect_bd_net -net microblaze_3_Clk [get_bd_pins LMB_Clk] \
  [get_bd_pins dlmb_v10/LMB_Clk] [get_bd_pins dlmb_bram_if_cntlr/LMB_Clk] [get_bd_pins ilmb_v10/LMB_Clk] \
  [get_bd_pins ilmb_bram_if_cntlr/LMB_Clk] [get_bd_pins dlmb_bram_if_cntlr/S_AXI_CTRL_ACLK] \
  [get_bd_pins ilmb_bram_if_cntlr/S_AXI_CTRL_ACLK]
connect_bd_net -net microblaze_3_dlmb_int [get_bd_pins dlmb_bram_if_cntlr/Interrupt] [get_bd_pins DLMB_Interrupt]
connect_bd_net -net microblaze_3_ilmb_int [get_bd_pins ilmb_bram_if_cntlr/Interrupt] [get_bd_pins ILMB_Interrupt]
connect_bd_net [get_bd_pins SYS_Rst] \
  [get_bd_pins dlmb_v10/SYS_Rst] [get_bd_pins dlmb_bram_if_cntlr/LMB_Rst] [get_bd_pins ilmb_v10/SYS_Rst] \
  [get_bd_pins ilmb_bram_if_cntlr/LMB_Rst]
connect_bd_net [get_bd_pins S_AXI_CTRL_ARESETN] \
  [get_bd_pins dlmb_bram_if_cntlr/S_AXI_CTRL_ARESETN] [get_bd_pins ilmb_bram_if_cntlr/S_AXI_CTRL_ARESETN]

current_bd_instance /microblaze_4_local_memory
connect_bd_intf_net [get_bd_intf_pins dlmb_v10/LMB_Sl_0] [get_bd_intf_pins dlmb_bram_if_cntlr/SLMB]
connect_bd_intf_net [get_bd_intf_pins ilmb_v10/LMB_Sl_0] [get_bd_intf_pins ilmb_bram_if_cntlr/SLMB]
connect_bd_intf_net [get_bd_intf_pins dlmb_bram_if_cntlr/BRAM_PORT] [get_bd_intf_pins lmb_bram/BRAM_PORTA]
connect_bd_intf_net [get_bd_intf_pins lmb_bram/BRAM_PORTB] [get_bd_intf_pins ilmb_bram_if_cntlr/BRAM_PORT]
connect_bd_intf_net [get_bd_intf_pins DLMB] [get_bd_intf_pins dlmb_v10/LMB_M]
connect_bd_intf_net [get_bd_intf_pins ILMB] [get_bd_intf_pins ilmb_v10/LMB_M]
connect_bd_intf_net [get_bd_intf_pins S_AXI_CTRL] [get_bd_intf_pins dlmb_bram_if_cntlr/S_AXI_CTRL]
connect_bd_intf_net [get_bd_intf_pins S_AXI_CTRL1] [get_bd_intf_pins ilmb_bram_if_cntlr/S_AXI_CTRL]
connect_bd_net -net microblaze_4_Clk [get_bd_pins LMB_Clk] \
  [get_bd_pins dlmb_v10/LMB_Clk] [get_bd_pins dlmb_bram_if_cntlr/LMB_Clk] [get_bd_pins ilmb_v10/LMB_Clk] \
  [get_bd_pins ilmb_bram_if_cntlr/LMB_Clk] [get_bd_pins dlmb_bram_if_cntlr/S_AXI_CTRL_ACLK] \
  [get_bd_pins ilmb_bram_if_cntlr/S_AXI_CTRL_ACLK]
connect_bd_net -net microblaze_4_dlmb_int [get_bd_pins dlmb_bram_if_cntlr/Interrupt] [get_bd_pins DLMB_Interrupt]
connect_bd_net -net microblaze_4_ilmb_int [get_bd_pins ilmb_bram_if_cntlr/Interrupt] [get_bd_pins ILMB_Interrupt]
connect_bd_net [get_bd_pins SYS_Rst] \
  [get_bd_pins dlmb_v10/SYS_Rst] [get_bd_pins dlmb_bram_if_cntlr/LMB_Rst] [get_bd_pins ilmb_v10/SYS_Rst] \
  [get_bd_pins ilmb_bram_if_cntlr/LMB_Rst]
connect_bd_net [get_bd_pins S_AXI_CTRL_ARESETN] \
  [get_bd_pins dlmb_bram_if_cntlr/S_AXI_CTRL_ARESETN] [get_bd_pins ilmb_bram_if_cntlr/S_AXI_CTRL_ARESETN]

current_bd_instance /microblaze_5_local_memory
connect_bd_intf_net [get_bd_intf_pins dlmb_v10/LMB_Sl_0] [get_bd_intf_pins dlmb_bram_if_cntlr/SLMB]
connect_bd_intf_net [get_bd_intf_pins ilmb_v10/LMB_Sl_0] [get_bd_intf_pins ilmb_bram_if_cntlr/SLMB]
connect_bd_intf_net [get_bd_intf_pins dlmb_bram_if_cntlr/BRAM_PORT] [get_bd_intf_pins lmb_bram/BRAM_PORTA]
connect_bd_intf_net [get_bd_intf_pins ilmb_bram_if_cntlr/BRAM_PORT] [get_bd_intf_pins lmb_bram/BRAM_PORTB]
connect_bd_intf_net [get_bd_intf_pins DLMB] [get_bd_intf_pins dlmb_v10/LMB_M]
connect_bd_intf_net [get_bd_intf_pins ILMB] [get_bd_intf_pins ilmb_v10/LMB_M]
connect_bd_intf_net [get_bd_intf_pins S_AXI_CTRL] [get_bd_intf_pins dlmb_bram_if_cntlr/S_AXI_CTRL]
connect_bd_intf_net [get_bd_intf_pins S_AXI_CTRL1] [get_bd_intf_pins ilmb_bram_if_cntlr/S_AXI_CTRL]
connect_bd_net -net microblaze_5_Clk [get_bd_pins LMB_Clk] \
  [get_bd_pins dlmb_v10/LMB_Clk] [get_bd_pins dlmb_bram_if_cntlr/LMB_Clk] [get_bd_pins ilmb_v10/LMB_Clk] \
  [get_bd_pins ilmb_bram_if_cntlr/LMB_Clk] [get_bd_pins dlmb_bram_if_cntlr/S_AXI_CTRL_ACLK] \
  [get_bd_pins ilmb_bram_if_cntlr/S_AXI_CTRL_ACLK]
connect_bd_net -net microblaze_5_dlmb_int [get_bd_pins dlmb_bram_if_cntlr/Interrupt] [get_bd_pins DLMB_Interrupt]
connect_bd_net -net microblaze_5_ilmb_int [get_bd_pins ilmb_bram_if_cntlr/Interrupt] [get_bd_pins ILMB_Interrupt]
connect_bd_net [get_bd_pins SYS_Rst] \
  [get_bd_pins dlmb_v10/SYS_Rst] [get_bd_pins dlmb_bram_if_cntlr/LMB_Rst] [get_bd_pins ilmb_v10/SYS_Rst] \
  [get_bd_pins ilmb_bram_if_cntlr/LMB_Rst]
connect_bd_net [get_bd_pins S_AXI_CTRL_ARESETN] \
  [get_bd_pins dlmb_bram_if_cntlr/S_AXI_CTRL_ARESETN] [get_bd_pins ilmb_bram_if_cntlr/S_AXI_CTRL_ARESETN]

current_bd_instance /
connect_bd_intf_net [get_bd_intf_pins microblaze_0/DLMB] [get_bd_intf_pins microblaze_0_local_memory/DLMB]
connect_bd_intf_net [get_bd_intf_pins microblaze_0/ILMB] [get_bd_intf_pins microblaze_0_local_memory/ILMB]
connect_bd_intf_net [get_bd_intf_pins microblaze_0_axi_periph/S00_AXI] [get_bd_intf_pins microblaze_0/M_AXI_DP]
connect_bd_intf_net [get_bd_intf_pins microblaze_0_axi_intc/interrupt] [get_bd_intf_pins microblaze_0/INTERRUPT]
connect_bd_intf_net [get_bd_intf_pins microblaze_0_axi_periph/M00_AXI] [get_bd_intf_pins microblaze_0_axi_intc/s_axi]
connect_bd_intf_net [get_bd_intf_pins mdm_1/MBDEBUG_0] [get_bd_intf_pins microblaze_0/DEBUG]
connect_bd_intf_net [get_bd_intf_pins microblaze_0_axi_periph/M01_AXI] [get_bd_intf_pins microblaze_0_local_memory/S_AXI_CTRL]
connect_bd_intf_net [get_bd_intf_pins microblaze_0_axi_periph/M02_AXI] [get_bd_intf_pins microblaze_0_local_memory/S_AXI_CTRL1]
connect_bd_intf_net [get_bd_intf_pins microblaze_1/DLMB] [get_bd_intf_pins microblaze_1_local_memory/DLMB]
connect_bd_intf_net [get_bd_intf_pins microblaze_1/ILMB] [get_bd_intf_pins microblaze_1_local_memory/ILMB]
connect_bd_intf_net [get_bd_intf_pins microblaze_1_axi_periph/S00_AXI] [get_bd_intf_pins microblaze_1/M_AXI_DP]
connect_bd_intf_net [get_bd_intf_pins microblaze_1_axi_intc/interrupt] [get_bd_intf_pins microblaze_1/INTERRUPT]
connect_bd_intf_net [get_bd_intf_pins microblaze_1_axi_periph/M00_AXI] [get_bd_intf_pins microblaze_1_axi_intc/s_axi]
connect_bd_intf_net [get_bd_intf_pins mdm_1/MBDEBUG_1] [get_bd_intf_pins microblaze_1/DEBUG]
connect_bd_intf_net [get_bd_intf_pins microblaze_1_axi_periph/M01_AXI] [get_bd_intf_pins microblaze_1_local_memory/S_AXI_CTRL]
connect_bd_intf_net [get_bd_intf_pins microblaze_1_axi_periph/M02_AXI] [get_bd_intf_pins microblaze_1_local_memory/S_AXI_CTRL1]
connect_bd_intf_net [get_bd_intf_pins microblaze_0_axi_periph/M03_AXI] [get_bd_intf_pins axi_gpio_0/S_AXI]
connect_bd_intf_net [get_bd_intf_pins microblaze_1_axi_periph/M03_AXI] [get_bd_intf_pins axi_uartlite_0/S_AXI]
connect_bd_intf_net [get_bd_intf_pins microblaze_2/DLMB] [get_bd_intf_pins microblaze_2_local_memory/DLMB]
connect_bd_intf_net [get_bd_intf_pins microblaze_2/ILMB] [get_bd_intf_pins microblaze_2_local_memory/ILMB]
connect_bd_intf_net [get_bd_intf_pins microblaze_2_axi_periph/S00_AXI] [get_bd_intf_pins microblaze_2/M_AXI_DP]
connect_bd_intf_net [get_bd_intf_pins microblaze_2_axi_intc/interrupt] [get_bd_intf_pins microblaze_2/INTERRUPT]
connect_bd_intf_net [get_bd_intf_pins microblaze_2_axi_periph/M00_AXI] [get_bd_intf_pins microblaze_2_axi_intc/s_axi]
connect_bd_intf_net [get_bd_intf_pins mdm_1/MBDEBUG_2] [get_bd_intf_pins microblaze_2/DEBUG]
connect_bd_intf_net [get_bd_intf_pins microblaze_2_axi_periph/M01_AXI] [get_bd_intf_pins microblaze_2_local_memory/S_AXI_CTRL]
connect_bd_intf_net [get_bd_intf_pins microblaze_2_axi_periph/M02_AXI] [get_bd_intf_pins microblaze_2_local_memory/S_AXI_CTRL1]
connect_bd_intf_net [get_bd_intf_pins microblaze_2_axi_periph/M03_AXI] [get_bd_intf_pins axi_uartlite_1/S_AXI]
connect_bd_intf_net [get_bd_intf_pins microblaze_3/DLMB] [get_bd_intf_pins microblaze_3_local_memory/DLMB]
connect_bd_intf_net [get_bd_intf_pins microblaze_3/ILMB] [get_bd_intf_pins microblaze_3_local_memory/ILMB]
connect_bd_intf_net [get_bd_intf_pins microblaze_3_axi_periph/S00_AXI] [get_bd_intf_pins microblaze_3/M_AXI_DP]
connect_bd_intf_net [get_bd_intf_pins microblaze_3_axi_intc/interrupt] [get_bd_intf_pins microblaze_3/INTERRUPT]
connect_bd_intf_net [get_bd_intf_pins microblaze_3_axi_periph/M00_AXI] [get_bd_intf_pins microblaze_3_axi_intc/s_axi]
connect_bd_intf_net [get_bd_intf_pins mdm_1/MBDEBUG_3] [get_bd_intf_pins microblaze_3/DEBUG]
connect_bd_intf_net [get_bd_intf_pins microblaze_3_axi_periph/M01_AXI] [get_bd_intf_pins microblaze_3_local_memory/S_AXI_CTRL]
connect_bd_intf_net [get_bd_intf_pins microblaze_3_axi_periph/M02_AXI] [get_bd_intf_pins microblaze_3_local_memory/S_AXI_CTRL1]
connect_bd_intf_net [get_bd_intf_pins microblaze_3_axi_periph/M03_AXI] [get_bd_intf_pins axi_uartlite_2/S_AXI]
connect_bd_intf_net [get_bd_intf_pins microblaze_4/DLMB] [get_bd_intf_pins microblaze_4_local_memory/DLMB]
connect_bd_intf_net [get_bd_intf_pins microblaze_4/ILMB] [get_bd_intf_pins microblaze_4_local_memory/ILMB]
connect_bd_intf_net [get_bd_intf_pins microblaze_4_axi_periph/S00_AXI] [get_bd_intf_pins microblaze_4/M_AXI_DP]
connect_bd_intf_net [get_bd_intf_pins microblaze_4_axi_intc/interrupt] [get_bd_intf_pins microblaze_4/INTERRUPT]
connect_bd_intf_net [get_bd_intf_pins microblaze_4_axi_periph/M00_AXI] [get_bd_intf_pins microblaze_4_axi_intc/s_axi]
connect_bd_intf_net [get_bd_intf_pins mdm_1/MBDEBUG_4] [get_bd_intf_pins microblaze_4/DEBUG]
connect_bd_intf_net [get_bd_intf_pins microblaze_4_axi_periph/M01_AXI] [get_bd_intf_pins microblaze_4_local_memory/S_AXI_CTRL]
connect_bd_intf_net [get_bd_intf_pins microblaze_4_axi_periph/M02_AXI] [get_bd_intf_pins microblaze_4_local_memory/S_AXI_CTRL1]
connect_bd_intf_net [get_bd_intf_pins microblaze_4_axi_periph/M03_AXI] [get_bd_intf_pins axi_gpio_1/S_AXI]
connect_bd_intf_net [get_bd_intf_pins microblaze_5/DLMB] [get_bd_intf_pins microblaze_5_local_memory/DLMB]
connect_bd_intf_net [get_bd_intf_pins microblaze_5/ILMB] [get_bd_intf_pins microblaze_5_local_memory/ILMB]
connect_bd_intf_net [get_bd_intf_pins microblaze_5_axi_periph/S00_AXI] [get_bd_intf_pins microblaze_5/M_AXI_DP]
connect_bd_intf_net [get_bd_intf_pins microblaze_5_axi_intc/interrupt] [get_bd_intf_pins microblaze_5/INTERRUPT]
connect_bd_intf_net [get_bd_intf_pins microblaze_5_axi_periph/M00_AXI] [get_bd_intf_pins microblaze_5_axi_intc/s_axi]
connect_bd_intf_net [get_bd_intf_pins mdm_1/MBDEBUG_5] [get_bd_intf_pins microblaze_5/DEBUG]
connect_bd_intf_net [get_bd_intf_pins microblaze_5_axi_periph/M01_AXI] [get_bd_intf_pins microblaze_5_local_memory/S_AXI_CTRL]
connect_bd_intf_net [get_bd_intf_pins microblaze_5_axi_periph/M02_AXI] [get_bd_intf_pins microblaze_5_local_memory/S_AXI_CTRL1]
connect_bd_intf_net [get_bd_intf_pins microblaze_5_axi_periph/M03_AXI] [get_bd_intf_pins axi_gpio_2/S_AXI]
connect_bd_intf_net [get_bd_intf_pins microblaze_3_axi_periph/M04_AXI] [get_bd_intf_pins AXItmrmvoter_0/S02_AXI]
connect_bd_intf_net [get_bd_intf_pins microblaze_2_axi_periph/M04_AXI] [get_bd_intf_pins AXItmrmvoter_0/S01_AXI]
connect_bd_intf_net [get_bd_intf_pins microblaze_1_axi_periph/M04_AXI] [get_bd_intf_pins AXItmrmvoter_0/S00_AXI]
connect_bd_intf_net [get_bd_intf_pins microblaze_1_axi_periph/M05_AXI] [get_bd_intf_pins axi_gpio_3/S_AXI]
connect_bd_intf_net [get_bd_intf_pins microblaze_2_axi_periph/M05_AXI] [get_bd_intf_pins axi_gpio_4/S_AXI]
connect_bd_intf_net [get_bd_intf_pins microblaze_3_axi_periph/M05_AXI] [get_bd_intf_pins axi_gpio_5/S_AXI]
connect_bd_net -net microblaze_0_intr [get_bd_pins microblaze_0_xlconcat/dout] [get_bd_pins microblaze_0_axi_intc/intr]
connect_bd_net -net microblaze_0_dlmb_int [get_bd_pins microblaze_0_local_memory/DLMB_Interrupt] [get_bd_pins microblaze_0_xlconcat/In0]
connect_bd_net -net microblaze_0_ilmb_int [get_bd_pins microblaze_0_local_memory/ILMB_Interrupt] [get_bd_pins microblaze_0_xlconcat/In1]
connect_bd_net -net microblaze_0_Clk [get_bd_pins clk_wiz_1/clk_out1] \
  [get_bd_pins microblaze_0_axi_intc/s_axi_aclk] [get_bd_pins microblaze_0_axi_intc/processor_clk] \
  [get_bd_pins rst_clk_wiz_1_100M/slowest_sync_clk] [get_bd_pins axi_gpio_0/s_axi_aclk] [get_bd_pins microblaze_0/Clk] \
  [get_bd_pins microblaze_0_local_memory/LMB_Clk] [get_bd_pins microblaze_0_axi_periph/ACLK] \
  [get_bd_pins microblaze_0_axi_periph/S00_ACLK] [get_bd_pins microblaze_0_axi_periph/M00_ACLK] \
  [get_bd_pins microblaze_0_axi_periph/M01_ACLK] [get_bd_pins microblaze_0_axi_periph/M02_ACLK] \
  [get_bd_pins microblaze_0_axi_periph/M03_ACLK] [get_bd_pins xlconcat_4/In0]
connect_bd_net [get_bd_pins clk_wiz_1/locked] [get_bd_pins rst_clk_wiz_1_100M/dcm_locked]
connect_bd_net [get_bd_pins rst_clk_wiz_1_100M/mb_reset] [get_bd_pins microblaze_0_axi_intc/processor_rst] [get_bd_pins microblaze_0/Reset]
connect_bd_net [get_bd_pins rst_clk_wiz_1_100M/bus_struct_reset] [get_bd_pins microblaze_0_local_memory/SYS_Rst]
connect_bd_net [get_bd_pins rst_clk_wiz_1_100M/interconnect_aresetn] \
  [get_bd_pins microblaze_0_axi_intc/s_axi_aresetn] [get_bd_pins microblaze_0_axi_periph/ARESETN] \
  [get_bd_pins microblaze_0_axi_periph/S00_ARESETN] [get_bd_pins microblaze_0_axi_periph/M00_ARESETN] \
  [get_bd_pins microblaze_0_axi_periph/M01_ARESETN] [get_bd_pins microblaze_0_axi_periph/M02_ARESETN] \
  [get_bd_pins microblaze_0_axi_periph/M03_ARESETN]
connect_bd_net [get_bd_pins mdm_1/Debug_SYS_Rst] \
  [get_bd_pins rst_clk_wiz_1_100M/mb_debug_sys_rst] [get_bd_pins rst_microblaze_1_clk_wiz_1_100M/mb_debug_sys_rst] \
  [get_bd_pins rst_microblaze_2_clk_wiz_1_100M/mb_debug_sys_rst] \
  [get_bd_pins rst_microblaze_3_clk_wiz_1_100M/mb_debug_sys_rst] \
  [get_bd_pins rst_microblaze_4_clk_wiz_1_100M/mb_debug_sys_rst] \
  [get_bd_pins rst_microblaze_5_clk_wiz_1_100M/mb_debug_sys_rst]
connect_bd_net -net microblaze_1_intr [get_bd_pins microblaze_1_xlconcat/dout] [get_bd_pins microblaze_1_axi_intc/intr]
connect_bd_net -net microblaze_1_dlmb_int [get_bd_pins microblaze_1_local_memory/DLMB_Interrupt] [get_bd_pins microblaze_1_xlconcat/In0]
connect_bd_net -net microblaze_1_ilmb_int [get_bd_pins microblaze_1_local_memory/ILMB_Interrupt] [get_bd_pins microblaze_1_xlconcat/In1]
connect_bd_net -net microblaze_1_Clk [get_bd_pins microblaze_1_clk_wiz_1/clk_out1] \
  [get_bd_pins microblaze_1_axi_intc/s_axi_aclk] [get_bd_pins microblaze_1_axi_intc/processor_clk] \
  [get_bd_pins rst_microblaze_1_clk_wiz_1_100M/slowest_sync_clk] [get_bd_pins axi_uartlite_0/s_axi_aclk] \
  [get_bd_pins microblaze_1/Clk] [get_bd_pins axi_gpio_3/s_axi_aclk] [get_bd_pins lmb_bram3/clka] \
  [get_bd_pins xlconcat_3/In2] [get_bd_pins AXItmrmvoter_0/s00_axi_aclk] [get_bd_pins memconformitymodule_2/clk] \
  [get_bd_pins microblaze_1_local_memory/LMB_Clk] [get_bd_pins microblaze_1_axi_periph/ACLK] \
  [get_bd_pins microblaze_1_axi_periph/S00_ACLK] [get_bd_pins microblaze_1_axi_periph/M00_ACLK] \
  [get_bd_pins microblaze_1_axi_periph/M01_ACLK] [get_bd_pins microblaze_1_axi_periph/M02_ACLK] \
  [get_bd_pins microblaze_1_axi_periph/M03_ACLK] [get_bd_pins microblaze_1_axi_periph/M04_ACLK] \
  [get_bd_pins microblaze_1_axi_periph/M05_ACLK]
connect_bd_net [get_bd_pins microblaze_1_clk_wiz_1/locked] [get_bd_pins rst_microblaze_1_clk_wiz_1_100M/dcm_locked]
connect_bd_net [get_bd_pins rst_microblaze_1_clk_wiz_1_100M/mb_reset] \
  [get_bd_pins microblaze_1_axi_intc/processor_rst] [get_bd_pins microblaze_1/Reset] [get_bd_pins lmb_bram3/rsta] \
  [get_bd_pins memconformitymodule_2/rst]
connect_bd_net [get_bd_pins rst_microblaze_1_clk_wiz_1_100M/bus_struct_reset] [get_bd_pins microblaze_1_local_memory/SYS_Rst]
connect_bd_net [get_bd_pins rst_microblaze_1_clk_wiz_1_100M/interconnect_aresetn] [get_bd_pins microblaze_1_axi_periph/ARESETN]
connect_bd_net [get_bd_pins rst_microblaze_1_clk_wiz_1_100M/peripheral_aresetn] \
  [get_bd_pins microblaze_1_axi_intc/s_axi_aresetn] [get_bd_pins axi_uartlite_0/s_axi_aresetn] \
  [get_bd_pins axi_gpio_3/s_axi_aresetn] [get_bd_pins AXItmrmvoter_0/s00_axi_aresetn] \
  [get_bd_pins microblaze_1_local_memory/S_AXI_CTRL_ARESETN] [get_bd_pins microblaze_1_axi_periph/S00_ARESETN] \
  [get_bd_pins microblaze_1_axi_periph/M00_ARESETN] [get_bd_pins microblaze_1_axi_periph/M01_ARESETN] \
  [get_bd_pins microblaze_1_axi_periph/M02_ARESETN] [get_bd_pins microblaze_1_axi_periph/M03_ARESETN] \
  [get_bd_pins microblaze_1_axi_periph/M04_ARESETN] [get_bd_pins microblaze_1_axi_periph/M05_ARESETN]
connect_bd_net [get_bd_ports clock_rtl] \
  [get_bd_pins clk_wiz_1/clk_in1] [get_bd_pins microblaze_1_clk_wiz_1/clk_in1] [get_bd_pins microblaze_2_clk_wiz_1/clk_in1] \
  [get_bd_pins microblaze_3_clk_wiz_1/clk_in1] [get_bd_pins microblaze_4_clk_wiz_1/clk_in1] \
  [get_bd_pins microblaze_5_clk_wiz_1/clk_in1]
connect_bd_net -net reset_rtl_0_1 [get_bd_ports reset_rtl_0] \
  [get_bd_pins rst_clk_wiz_1_100M/ext_reset_in] [get_bd_pins rst_microblaze_1_clk_wiz_1_100M/ext_reset_in] \
  [get_bd_pins rst_microblaze_2_clk_wiz_1_100M/ext_reset_in] [get_bd_pins rst_microblaze_3_clk_wiz_1_100M/ext_reset_in] \
  [get_bd_pins rst_microblaze_4_clk_wiz_1_100M/ext_reset_in] [get_bd_pins rst_microblaze_5_clk_wiz_1_100M/ext_reset_in]
connect_bd_net [get_bd_ports reset_rtl] \
  [get_bd_pins clk_wiz_1/reset] [get_bd_pins microblaze_1_clk_wiz_1/reset] [get_bd_pins microblaze_2_clk_wiz_1/reset] \
  [get_bd_pins microblaze_3_clk_wiz_1/reset] [get_bd_pins microblaze_4_clk_wiz_1/reset] \
  [get_bd_pins microblaze_5_clk_wiz_1/reset] [get_bd_pins tmrit_0/rst]
connect_bd_net -net microblaze_2_intr [get_bd_pins microblaze_2_xlconcat/dout] [get_bd_pins microblaze_2_axi_intc/intr]
connect_bd_net -net microblaze_2_dlmb_int [get_bd_pins microblaze_2_local_memory/DLMB_Interrupt] [get_bd_pins microblaze_2_xlconcat/In0]
connect_bd_net -net microblaze_2_ilmb_int [get_bd_pins microblaze_2_local_memory/ILMB_Interrupt] [get_bd_pins microblaze_2_xlconcat/In1]
connect_bd_net -net microblaze_2_Clk [get_bd_pins microblaze_2_clk_wiz_1/clk_out1] \
  [get_bd_pins microblaze_2_axi_intc/s_axi_aclk] [get_bd_pins microblaze_2_axi_intc/processor_clk] \
  [get_bd_pins rst_microblaze_2_clk_wiz_1_100M/slowest_sync_clk] [get_bd_pins axi_uartlite_1/s_axi_aclk] \
  [get_bd_pins microblaze_2/Clk] [get_bd_pins axi_gpio_4/s_axi_aclk] [get_bd_pins lmb_bram4/clka] \
  [get_bd_pins xlconcat_3/In1] [get_bd_pins AXItmrmvoter_0/s01_axi_aclk] [get_bd_pins memconformitymodule_1/clk] \
  [get_bd_pins microblaze_2_local_memory/LMB_Clk] [get_bd_pins microblaze_2_axi_periph/ACLK] \
  [get_bd_pins microblaze_2_axi_periph/S00_ACLK] [get_bd_pins microblaze_2_axi_periph/M00_ACLK] \
  [get_bd_pins microblaze_2_axi_periph/M01_ACLK] [get_bd_pins microblaze_2_axi_periph/M02_ACLK] \
  [get_bd_pins microblaze_2_axi_periph/M03_ACLK] [get_bd_pins microblaze_2_axi_periph/M04_ACLK] \
  [get_bd_pins microblaze_2_axi_periph/M05_ACLK]
connect_bd_net [get_bd_pins microblaze_2_clk_wiz_1/locked] [get_bd_pins rst_microblaze_2_clk_wiz_1_100M/dcm_locked]
connect_bd_net [get_bd_pins rst_microblaze_2_clk_wiz_1_100M/mb_reset] \
  [get_bd_pins microblaze_2_axi_intc/processor_rst] [get_bd_pins microblaze_2/Reset] [get_bd_pins lmb_bram4/rsta] \
  [get_bd_pins memconformitymodule_1/rst]
connect_bd_net [get_bd_pins rst_microblaze_2_clk_wiz_1_100M/bus_struct_reset] [get_bd_pins microblaze_2_local_memory/SYS_Rst]
connect_bd_net [get_bd_pins rst_microblaze_2_clk_wiz_1_100M/interconnect_aresetn] [get_bd_pins microblaze_2_axi_periph/ARESETN]
